# EasyEDA Pro project ProProject_module_robot-.epro

# Schematic Schematic1
Create Date: 2022-07-11; Page Name: P1; Project Name: module_robot; Schematic Name: Schematic1; Update Date: 2022-07-15; Add into BOM: yes; Convert to PCB: yes
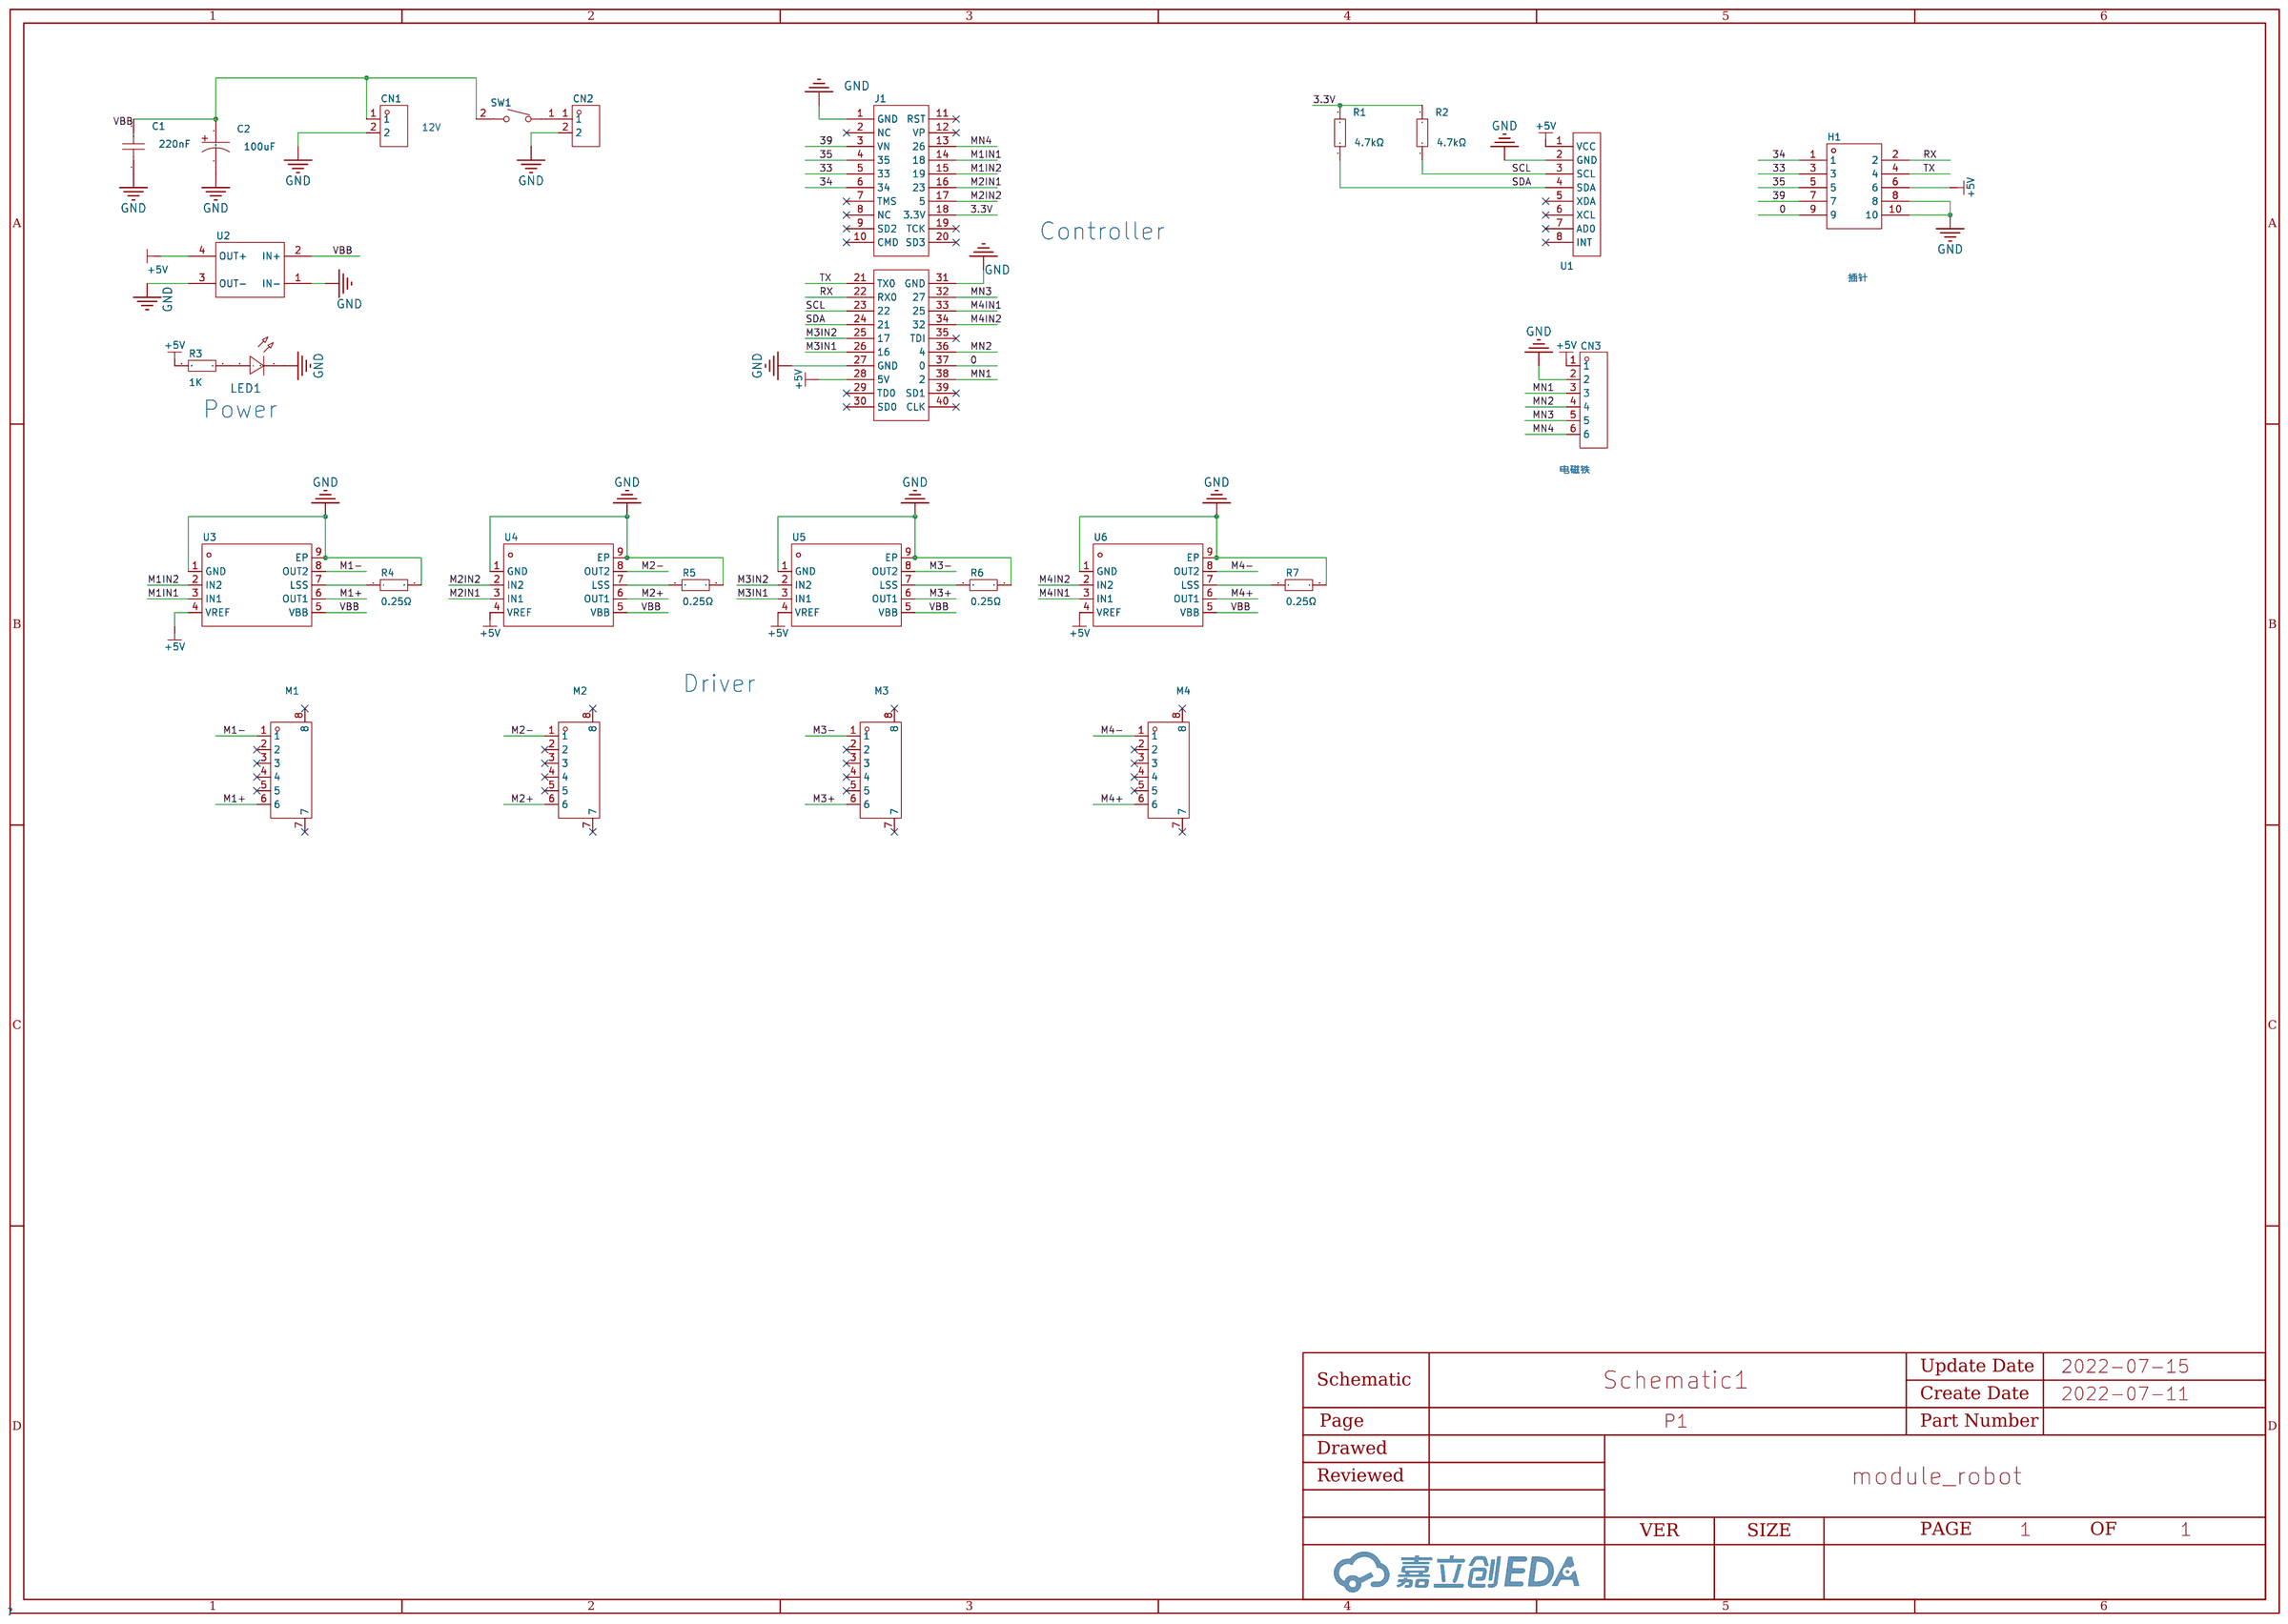
[diagram p0: schematic sheet]

## Parts
C1  220nF  [C0603]
C2  100uF  [CAP-TH_BD8.0-P3.50-D0.6-FD]
CN1  -  [CONN-TH_2P-P2.50_HCTL_HC-5264-2A]
CN2  -  [CONN-TH_2P-P2.50_HCTL_HC-5264-2A]
CN3  -  [CONN-TH_6P-P2.50_HCTL_HC-5264-6A]
H1  -  [HDR-TH_10P-P2.54-V-M-R2-C5-S2.54]
J1  -  [esp32TTGO]
LED1  -  [LED0603-RD_BLUE]
M1  -  [CONN-SMD_KH-ZH1.5WF-06A]
M2  -  [CONN-SMD_KH-ZH1.5WF-06A]
M3  -  [CONN-SMD_KH-ZH1.5WF-06A]
M4  -  [CONN-SMD_KH-ZH1.5WF-06A]
R1  4.7kΩ  [R0805]
R2  4.7kΩ  [R0805]
R3  1K  [R0603]
R4  0.25Ω  [R2512]
R5  0.25Ω  [R2512]
R6  0.25Ω  [R2512]
R7  0.25Ω  [R2512]
SW1  MR5-111-C5N-WW  [SW-TH_MR5-111-C5N-BB]
U1  -  [MPU6050]
U2  -  [DC-DC降压5/3.3V]
U3  -  [SOIC-8_L4.9-W3.9-P1.27-LS6.0-BL-EP]
U4  -  [SOIC-8_L4.9-W3.9-P1.27-LS6.0-BL-EP]
U5  -  [SOIC-8_L4.9-W3.9-P1.27-LS6.0-BL-EP]
U6  -  [SOIC-8_L4.9-W3.9-P1.27-LS6.0-BL-EP]

## Library data of the parts
C1 = TCC0603X5R224M250CT: 容值:220nF;精度:±20%;额定电压:25V;温度系数:X5R;; LCSC Part Name: 220nF ±20% 25V; Supplier Part: C713508; Manufacturer: CCTC(三环); Supplier Footprint: 0603; JLCPCB Part Class: Extended Part; Datasheet: https://atta.szlcsc.com/upload/public/pdf/source/20191203/C466239_F62A586702D44EEA1C39B32FC8662B21.pdf; Supplier: LCSC; Tolerance: ±20%; Voltage Rated: 25V; Temperature Coefficient: X5R
C2 = RG050M101LO8*12TA-1A1E: 电容体长度:12mm;工作寿命:7000hrs 105;额定电压:50V;精度:±20%;容值:100uF;脚间距:3.5mm;电容体直径:8mm;工作温度:-;; LCSC Part Name: 100uF 50V; Supplier Part: C357618; Manufacturer: BERYL(绿宝石); Supplier Footprint: 径向引线,8x12mm; JLCPCB Part Class: Extended Part; Datasheet: https://atta.szlcsc.com/upload/public/pdf/source/20190103/C357618_801ED3488CFC347CF061378E61C4C2ED.pdf; Supplier: LCSC; L: 12mm; Lifetime @ Temp: 7000hrs 105; Rated Voltage: 50V; Tolerance: ±20%; Lead Spacing: 3.5mm; φD: 8mm
CN1 CN2 = HC-5264-2A: 参考系列:-;间距:2.5mm;插针结构:1x2P;排数:1;每排PIN数:2;行距:-;公母:公型插针;安装方式:直插;额定电流:3A;工作温度范围:-25~+85;; LCSC Part Name: 2P 间距P=2.5mm; Supplier Part: C2845814; Manufacturer: HCTL(华灿天禄); Supplier Footprint: 插件,P=2.5mm; JLCPCB Part Class: Extended Part; Datasheet: https://atta.szlcsc.com/upload/public/pdf/source/20210728/C2845814_DFD3D2538445536899F79025E2B03A5C.pdf; Supplier: LCSC; Pitch: 2.5mm; Pins Structure: 1x2P; Number of Rows: 1; Number of PINs Per Row: 2; Gender: 公型插针; Mounting Style: 直插; Current Rating (Max): 3A; Operating Temperature Range: -25~+85
CN3 = HC-5264-6A: 参考系列:-;间距:2.5mm;插针结构:1x6P;排数:1;每排PIN数:6;行距:-;公母:公型插针;安装方式:直插;额定电流:3A;工作温度范围:-25~+85;; LCSC Part Name: 6P 间距P=2.5mm; Supplier Part: C2845818; Manufacturer: HCTL(华灿天禄); Supplier Footprint: 插件,P=2.5mm; JLCPCB Part Class: Extended Part; Datasheet: https://atta.szlcsc.com/upload/public/pdf/source/20210728/C2845814_DFD3D2538445536899F79025E2B03A5C.pdf; Supplier: LCSC; Pitch: 2.5mm; Pins Structure: 1x6P; Number of Rows: 1; Number of PINs Per Row: 6; Gender: 公型插针; Mounting Style: 直插; Current Rating (Max): 3A; Operating Temperature Range: -25~+85
H1 = HDR-M_2.54_2x5: Supplier Part: C124387; Supplier Footprint: 插件,P=2.54mm
J1 = esp32ttgo: esp32TTGO扩展封装
LED1 = LED_0603-R: 发光颜色:红灯;二极管配置:-;透镜颜色:无色透明;主波长:617.5nm;峰值波长:632nm;色温:-;光通量(25时):-;测试电流:5mA;正向电压(VF):2.2V;发光强度:28.5mcd;功率:60mW;发光角度:120°;安装方式:-;工作温度:-40~+85;; Supplier Footprint: 0603; Supplier Part: C72044
M1-M4 = KH-ZH1.5WF-06A: 参考系列:-;间距:1.5mm;插针结构:1x6P;排数:1;每排PIN数:6;行距:-;公母:公型插针;安装方式:卧贴;额定电流:500mA;工作温度范围:-25~+85;; LCSC Part Name: 6P 1.5mm; Supplier Part: C2688783; Manufacturer: kinghelm(金航标); Supplier Footprint: SMD,P=1.5mm; JLCPCB Part Class: Extended Part; Datasheet: https://atta.szlcsc.com/upload/public/pdf/source/20210202/C2688783_C9B428B3014D7ABB89BDB1FE60180D57.pdf; Supplier: LCSC; Pitch: 1.5mm; Pins Structure: 1x6P; Number of Rows: 1; Number of PINs Per Row: 6; Gender: 公型插针; Mounting Style: 卧贴; Current Rating (Max): 500mA; Operating Temperature Range: -25~+85
R1 R2 = AR05DTCW1002: 电阻类型:薄膜电阻;阻值:10kΩ;精度:±0.5%;功率:125mW;温度系数:±25ppm/;最大工作电压:100V;工作温度范围:-55~+155;; LCSC Part Name: 10kΩ ±0.5% 125mW; Supplier Part: C319941; Manufacturer: 光颉(Viking); Supplier Footprint: 0805; JLCPCB Part Class: Extended Part; Datasheet: https://atta.szlcsc.com/upload/public/pdf/source/20181220/C319941_05776DBB286B9ED5294631979742F42B.pdf; Supplier: LCSC; Type: 薄膜电阻; Tolerance: ±0.5%; Power(Watts): 125mW; Temperature Coefficient: ±25ppm/; Overload Voltage (Max): 100V; Operating Temperature Range: -55~+155
R3 = Res_0603: Supplier Footprint: 0603
R4-R7 = CR2512FR250E04R: 阻值:0.25Ω;精度:±1%;功率:1W;温度系数:±600ppm/;; LCSC Part Name: 0.25Ω ±1% 1W; Supplier Part: C147045; Manufacturer: EVER OHMS(天二科技); Supplier Footprint: 2512; JLCPCB Part Class: Extended Part; Datasheet: https://atta.szlcsc.com/upload/public/pdf/source/20190415/C147045_33CEE595C231E45FD259EF7951295D1A.pdf; Supplier: LCSC; Tolerance: ±1%; Power(Watts): 1W; Temperature Coefficient: ±600ppm/
SW1 = MR5-111-C5N-WW: 船型开关@@小型船型开关，10x15在业界少有的; LCSC Part Name: 船型开关; Supplier Part: C2981293; Manufacturer: D-SWITCH(德崧); Supplier Footprint: 插件; Datasheet: https://atta.szlcsc.com/upload/public/pdf/source/20220324/C7B0C801CE9A8534BD2A1473F2C66A3D.pdf; Supplier: LCSC
U1 = MPU6050: MPU6050外形封装
U2 = DC-DC降压5/3.3V
U3-U6 = A4950ELJTR-T: 全桥DMOS PWM电机驱动器; Supplier Part: C82404; Manufacturer: ALLEGRO(美国埃戈罗); Supplier Footprint: SOIC-8_EP_150mil; JLCPCB Part Class: Extended Part; Datasheet: https://atta.szlcsc.com/upload/public/pdf/source/20161024/1477288450284.pdf; Supplier: LCSC

## Nets
3.3V: J1.18(3.3V) R1.2 R2.2
+5V: CN3.1 H1.6 J1.28(5V) R3.1 U1.1(VCC) U2.4(OUT+) U3.4(VREF) U4.4(VREF) U5.4(VREF) U6.4(VREF)
GND: C1.1 C2.2 CN1.2 CN2.2 CN3.2 H1.8 H1.10 J1.1(GND) J1.27(GND) J1.31(GND) LED1.1(C) R4.2 R5.2 R6.2 R7.2 U1.2(GND) U2.1(IN-) U2.3(OUT-) U3.1(GND) U3.9(EP) U4.1(GND) U4.9(EP) U5.1(GND) U5.9(EP) U6.1(GND) U6.9(EP)
0: H1.9 J1.37(0)
33: H1.3 J1.5(33)
34: H1.1 J1.6(34)
35: H1.5 J1.4(35)
39: H1.7 J1.3(VN)
M1+: M1.6 U3.6(OUT1)
M1-: M1.1 U3.8(OUT2)
M1IN1: J1.14(18) U3.3(IN1)
M1IN2: J1.15(19) U3.2(IN2)
M2+: M2.6 U4.6(OUT1)
M2-: M2.1 U4.8(OUT2)
M2IN1: J1.16(23) U4.3(IN1)
M2IN2: J1.17(5) U4.2(IN2)
M3+: M3.6 U5.6(OUT1)
M3-: M3.1 U5.8(OUT2)
M3IN1: J1.26(16) U5.3(IN1)
M3IN2: J1.25(17) U5.2(IN2)
M4+: M4.6 U6.6(OUT1)
M4-: M4.1 U6.8(OUT2)
M4IN1: J1.33(25) U6.3(IN1)
M4IN2: J1.34(32) U6.2(IN2)
MN1: CN3.3 J1.38(2)
MN2: CN3.4 J1.36(4)
MN3: CN3.5 J1.32(27)
MN4: CN3.6 J1.13(26)
RX: H1.2 J1.22(RX0)
SCL: J1.23(22) R2.1 U1.3(SCL)
SDA: J1.24(21) R1.1 U1.4(SDA)
TX: H1.4 J1.21(TX0)
VBB: C1.2 C2.1 CN1.1 SW1.2 U2.2(IN+) U3.5(VBB) U4.5(VBB) U5.5(VBB) U6.5(VBB)
$1N2313: R6.1 U5.7(LSS)
$1N2314: R7.1 U6.7(LSS)
$1N2315: R5.1 U4.7(LSS)
$1N2316: R4.1 U3.7(LSS)
$1N8660: LED1.2(A) R3.2
$1N10061: CN2.1 SW1.1

Not connected (* = marked no-connect by the designer): J1 2(NC)* 7(TMS)* 8(NC)* 9(SD2)* 10(CMD)* 11(RST)* 12(VP)* 19(TCK)* 20(SD3)* 29(TD0)* 30(SD0)* 35(TDI)* 39(SD1)* 40(CLK)*; M1 2* 3* 4* 5* 7* 8*; M2 2* 3* 4* 5* 7* 8*; M3 2* 3* 4* 5* 7* 8*; M4 2* 3* 4* 5* 7* 8*; U1 5(XDA)* 6(XCL)* 7(AD0)* 8(INT)*

## Notes on the sheet
- 12V
- Controller
- 插针
- Power
- 电磁铁
- Driver

# Board PCB1
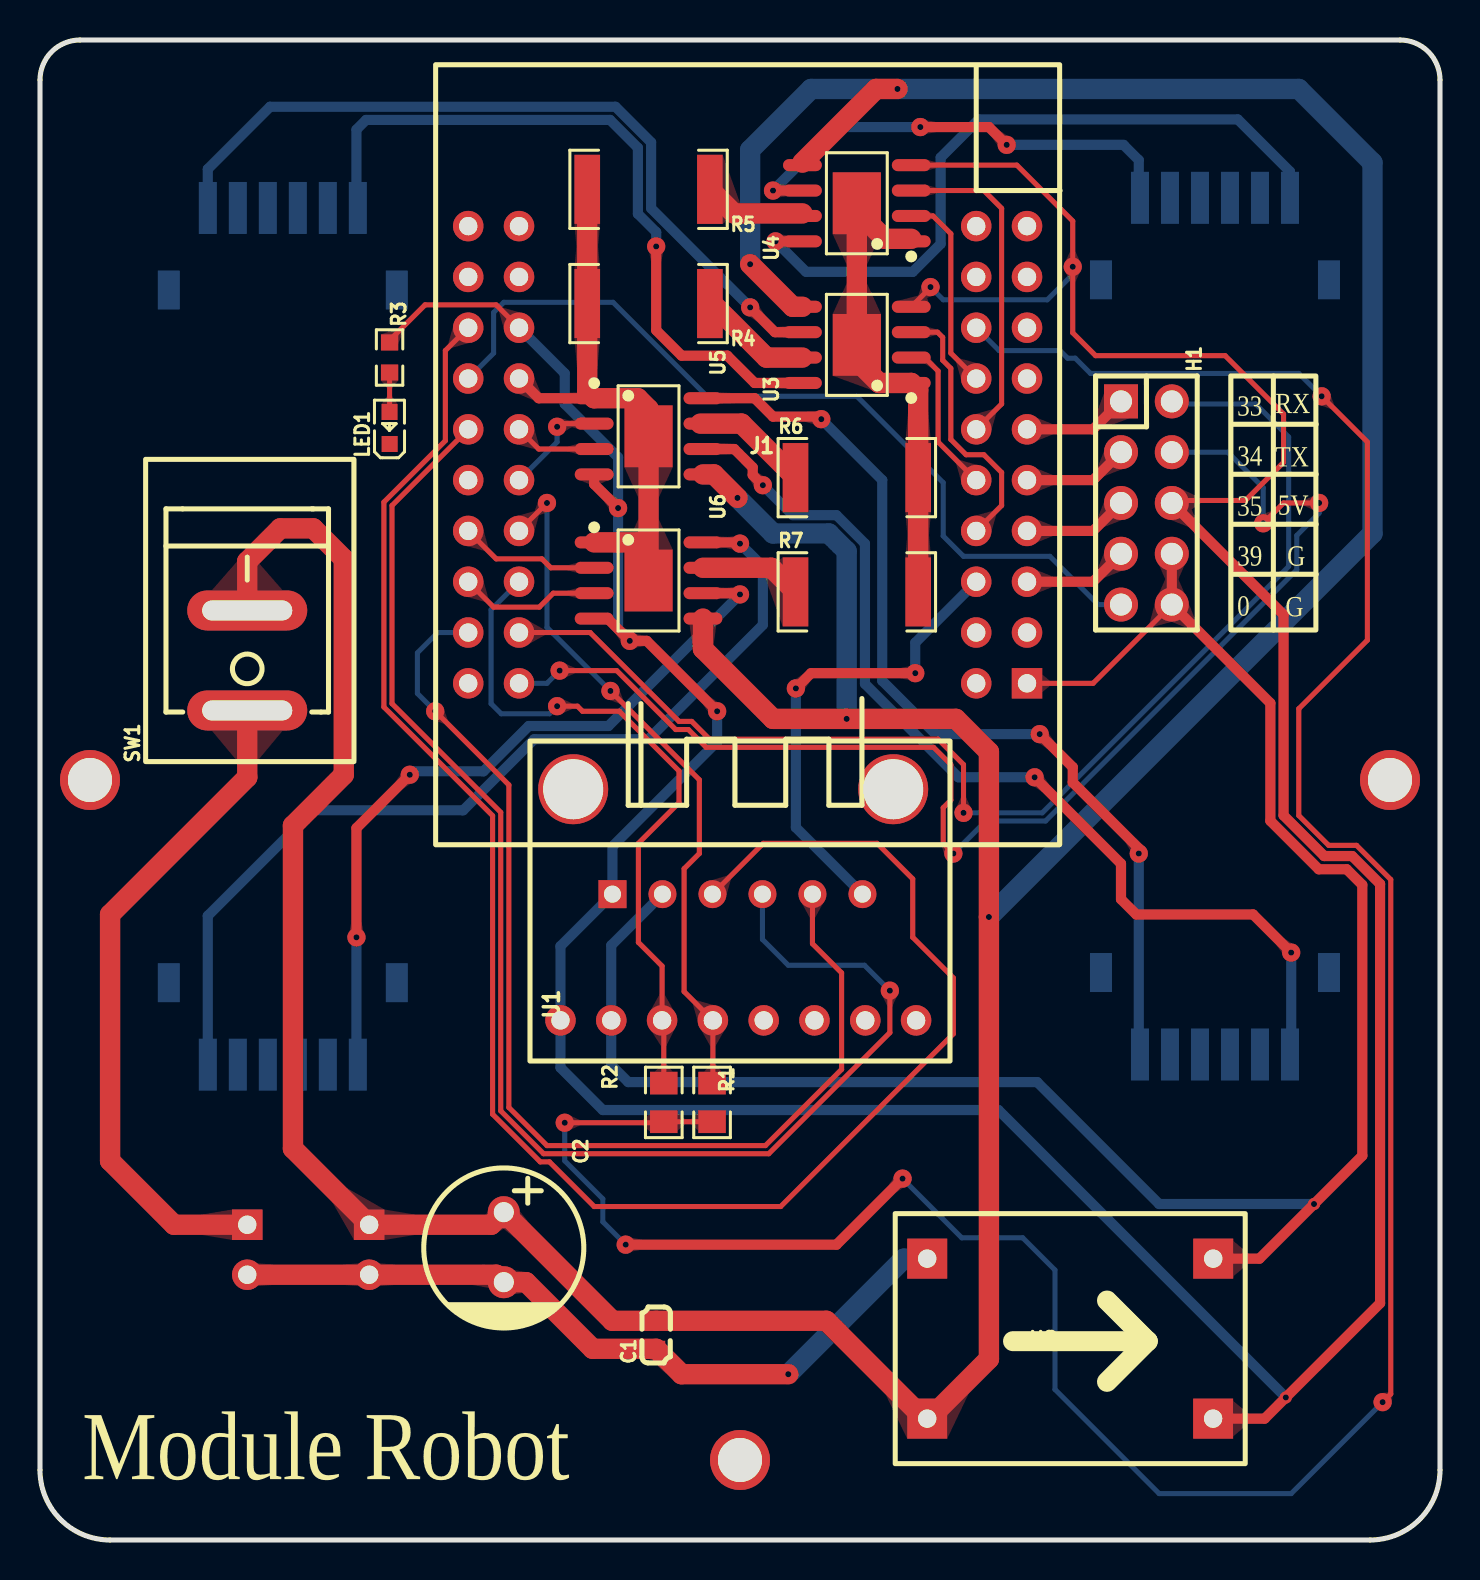
[diagram p1: board, top side]
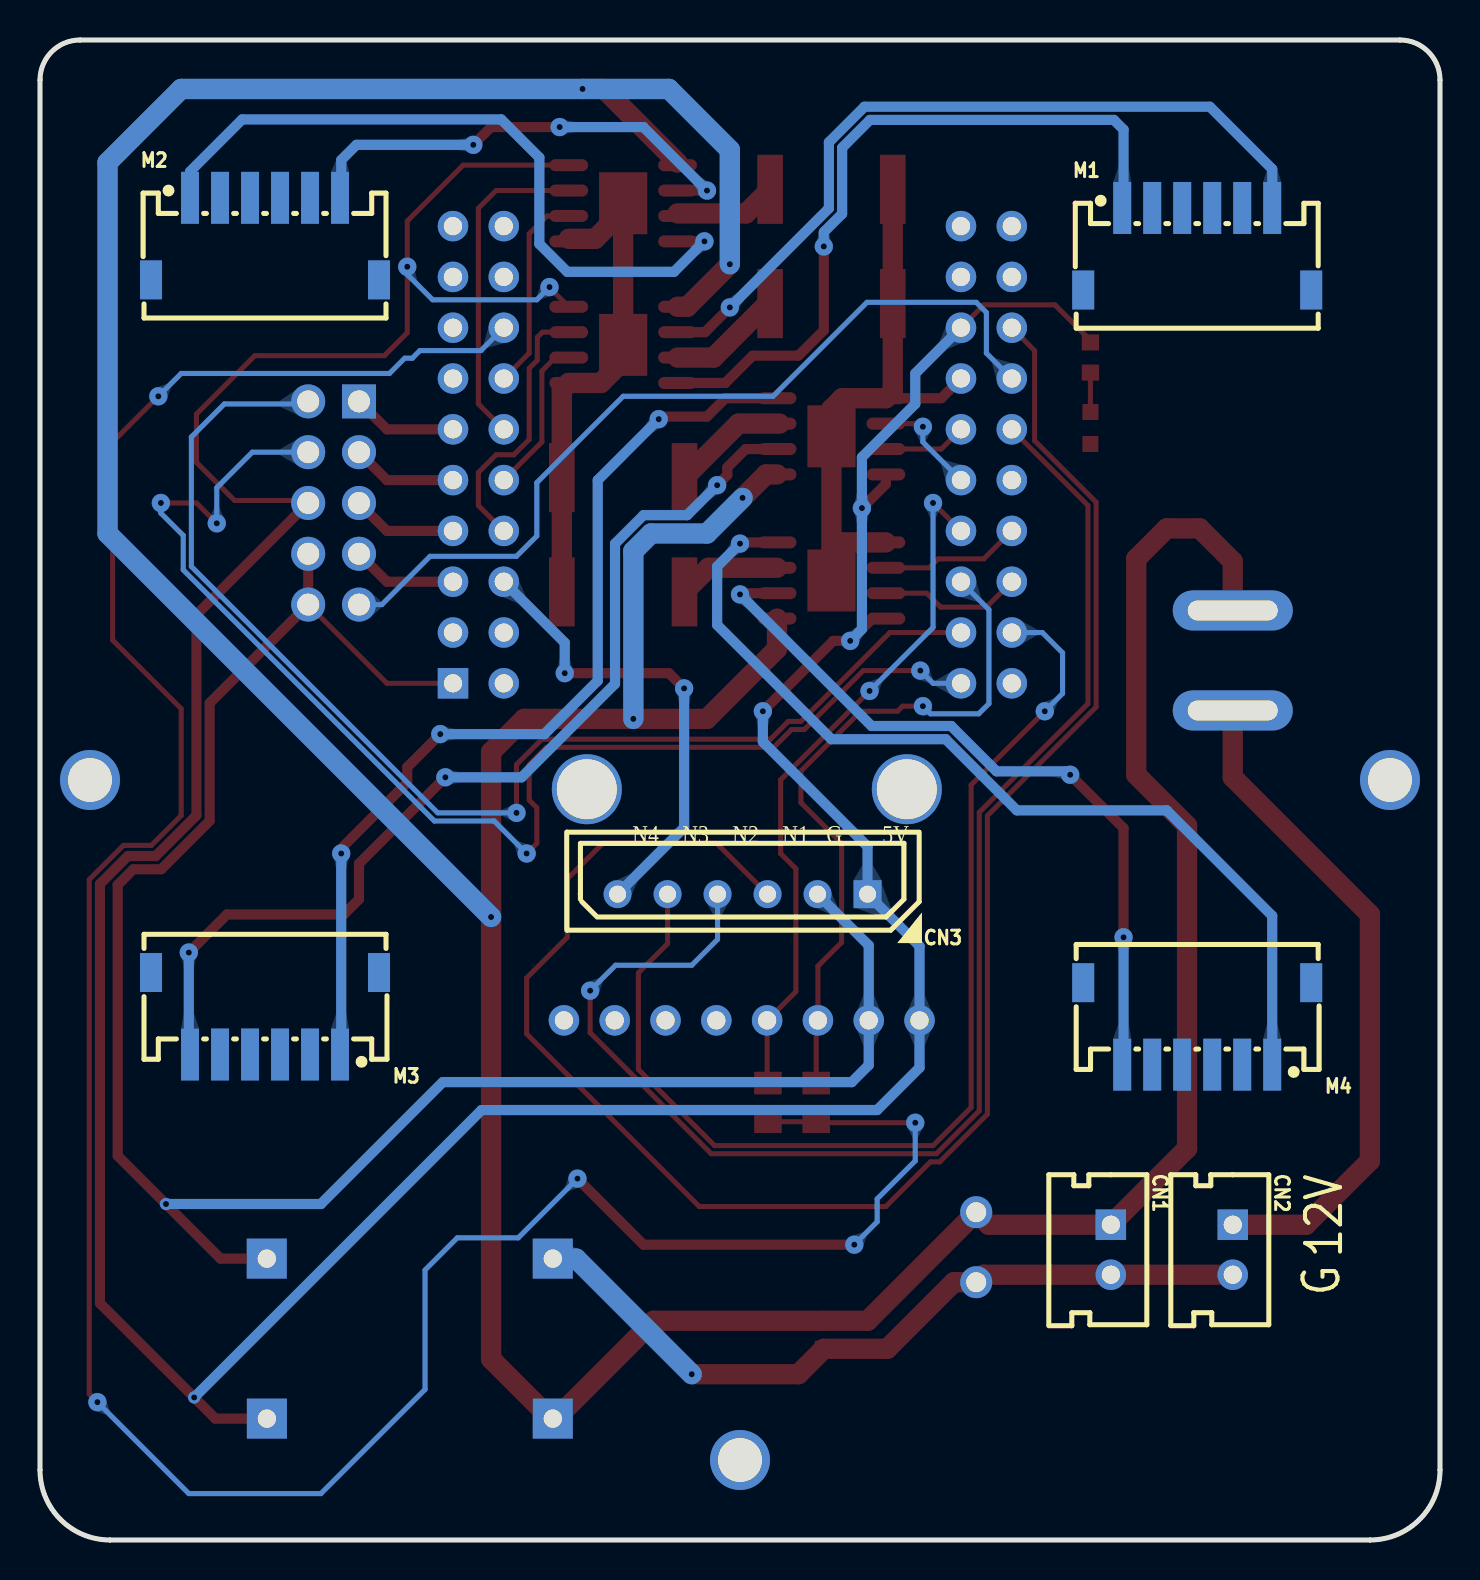
[diagram p2: board, bottom side, seen from below]

Outline 70 x 75 mm; copper layers: Top Layer, Bottom Layer. Coordinates in mm from the lower left corner of the outline.
Outline path: 0,73 arc(0.59,74.41) 2,75 68,75 arc(69.41,74.41) 70,73 70,3.5 arc(68.97,1.03) 66.5,0 3.5,0 arc(1.03,1.03) 0,3.5 0,73
Stack: Top Layer 0.035mm / Dielectric1 1.51mm FR4 er 4.5 / Bottom Layer 0.035mm

## Design rules (mm)
spacing safeClearance (default): track to track 0.152, other pairs 0.152 to 0.3
track width trackWidth (default): min 0.127, default 0.254, max 2.54
differential pair differentialPair (default): width min 0.127, default 0.254, max 2.54; gap min 0.152, default 0.152
via viaSize (default): diameter min 0.5, default 0.61, max 10; hole min 0.3, default 0.305, max 6

## Placement (name value [footprint] x y rotation side)
C1  220nF  [C0603]  30.81 10.26 90 top
C2  100uF  [CAP-TH_BD8.0-P3.50-D0.6-FD]  23.19 14.64 270 top
CN1  -  [CONN-TH_2P-P2.50_HCTL_HC-5264-2A]  16.46 14.51 270 bottom
CN2  -  [CONN-TH_2P-P2.50_HCTL_HC-5264-2A]  10.36 14.51 270 bottom
CN3  -  [CONN-TH_6P-P2.50_HCTL_HC-5264-6A]  34.87 32.29 0 bottom
H1  -  [HDR-TH_10P-P2.54-V-M-R2-C5-S2.54]  55.32 51.85 270 top
J1  -  [esp32TTGO]  35.38 54.26 180 top
LED1  -  [LED0603-RD_BLUE]  17.48 55.6 90 top
M1  -  [CONN-SMD_KH-ZH1.5WF-06A]  12.14 64.55 180 bottom
M2  -  [CONN-SMD_KH-ZH1.5WF-06A]  58.75 65.06 180 bottom
M3  -  [CONN-SMD_KH-ZH1.5WF-06A]  58.75 26.32 0 bottom
M4  -  [CONN-SMD_KH-ZH1.5WF-06A]  12.14 25.82 0 bottom
NOREF  -  [Pad_e193]  67.5 38 0 top
NOREF#2  -  [Pad_e192]  2.5 38 0 top
NOREF#3  -  [Pad_e194]  35 4 0 top
R1  4.7kΩ  [R0805]  33.6 21.88 270 top
R2  4.7kΩ  [R0805]  31.19 21.88 270 top
R3  1K  [R0603]  17.48 59.13 270 top
R4  0.25Ω  [R2512]  30.43 61.82 180 top
R5  0.25Ω  [R2512]  30.43 67.53 180 top
R6  0.25Ω  [R2512]  40.84 53.12 0 top
R7  0.25Ω  [R2512]  40.84 47.41 0 top
SW1  MR5-111-C5N-WW  [SW-TH_MR5-111-C5N-BB]  10.36 43.98 90 top
U1  -  [MPU6050]  26.02 25.98 90 top
U2  -  [DC-DC降压5/3.3V]  51.51 10.07 0 top
U3  -  [SOIC-8_L4.9-W3.9-P1.27-LS6.0-BL-EP]  40.84 59.76 90 top
U4  -  [SOIC-8_L4.9-W3.9-P1.27-LS6.0-BL-EP]  40.84 66.84 90 top
U5  -  [SOIC-8_L4.9-W3.9-P1.27-LS6.0-BL-EP]  30.43 55.18 270 top
U6  -  [SOIC-8_L4.9-W3.9-P1.27-LS6.0-BL-EP]  30.43 47.98 270 top

## Footprints (pads in the part's own frame, mm; a bottom-side part is the same pattern mirrored in y, then rotated)
C0603
  rect 0.8x0.9 smd: 1(-0.7,0) 2(0.7,0)
CAP-TH_BD8.0-P3.50-D0.6-FD
  round 1.6 hole 1: 1(-1.75,0) 2(1.75,0)
CONN-SMD_KH-ZH1.5WF-06A
  rect 0.9x2.6 smd: 1(-3.75,2.05) 2(-2.25,2.05) 3(-0.75,2.05) 4(0.75,2.05) 5(2.25,2.05) 6(3.75,2.05)
  rect 1.1x1.95 smd: 7(5.7,-2.05) 8(-5.7,-2.05)
CONN-TH_2P-P2.50_HCTL_HC-5264-2A
  rect 1.524x1.524 hole 0.914: 1(-1.25,0)
  round 1.524 hole 0.914: 2(1.25,0)
CONN-TH_6P-P2.50_HCTL_HC-5264-6A
  rect 1.4x1.4 hole 0.85: 1(-6.25,0)
  round 1.4 hole 0.85: 2(-3.75,0) 3(-1.25,0) 4(1.25,0) 5(3.75,0) 6(6.25,0)
DC-DC降压5/3.3V
  rect 2x2 hole 0.914: 1(-7.15,4) 2(-7.15,-4) 3(7.15,4) 4(7.145,-4)
esp32TTGO
  rect 1.524x1.524 hole 0.914: 1(-13.97,11.43)
  round 1.524 hole 0.914: 2(-13.97,8.89) 3(-13.97,6.35) 4(-13.97,3.81) 5(-13.97,1.27) 6(-13.97,-1.27) 7(-13.97,-3.81) 8(-13.97,-6.35) 9(-13.97,-8.89) 10(-13.97,-11.43) 11(-11.43,11.43) 12(-11.43,8.89) 13(-11.43,6.35) 14(-11.43,3.81) 15(-11.43,1.27) 16(-11.43,-1.27) 17(-11.43,-3.81) 18(-11.43,-6.35) 19(-11.43,-8.89) 20(-11.43,-11.43) 21(11.43,11.43) 22(11.43,8.89) 23(11.43,6.35) 24(11.43,3.81) 25(11.43,1.27) 26(11.43,-1.27) 27(11.43,-3.81) 28(11.43,-6.35) 29(11.43,-8.89) 30(11.43,-11.43) 31(13.97,11.43) 32(13.97,8.89) 33(13.97,6.35) 34(13.97,3.81) 35(13.97,1.27) 36(13.97,-1.27) 37(13.97,-3.81) 38(13.97,-6.35) 39(13.97,-8.89) 40(13.97,-11.43)
HDR-TH_10P-P2.54-V-M-R2-C5-S2.54
  rect 1.7x1.7 hole 1.1: 1(-5.08,-1.27)
  round 1.7 hole 1.1: 2(-5.08,1.27) 3(-2.54,-1.27) 4(-2.54,1.27) 5(0,-1.27) 6(0,1.27) 7(2.54,-1.27) 8(2.54,1.27) 9(5.08,-1.27) 10(5.08,1.27)
LED0603-RD_BLUE
  rect 0.8x0.8 smd: 1(-0.8,-0.003) 2(0.8,0.003)
MPU6050
  round 1.524 hole 0.914: 1(0,0) 2(0,-2.54) 3(0,-5.08) 4(0,-7.62) 5(0,-10.16) 6(0,-12.7) 7(0,-15.24) 8(0,-17.78)
  round 3.5 hole 3: 9(11.557,-0.635) 10(11.557,-16.635)
Pad_e192
  round 3 hole 2.2: 1(0,0)
Pad_e193
  round 3 hole 2.2: 2(0,0)
Pad_e194
  round 3 hole 2.2: 3(0,0)
R0603
  rect 0.806x0.864 smd: 1(-0.753,0) 2(0.753,0)
R0805
  rect 1.133x1.377 smd: 1(-0.966,0) 2(0.966,0)
R2512
  rect 1.282x3.456 smd: 1(-3.067,0) 2(3.067,0)
SOIC-8_L4.9-W3.9-P1.27-LS6.0-BL-EP
  oval 0.602x1.941 smd: 1(-1.905,-2.72) 2(-0.635,-2.72) 3(0.635,-2.72) 4(1.905,-2.72) 5(1.905,2.72) 6(0.635,2.72) 7(-0.635,2.72) 8(-1.905,2.72)
  rect 3.098x2.41 smd: 9(0,0)
SW-TH_MR5-111-C5N-BB
  oval 2x6 hole 1x4.5: 1(-2.5,0) 2(2.5,0)

## Nets
As in the schematic.

Pads without a net: J1 2 7 8 9 10 11 12 19 20 29 30 35 39 40; M1 2 3 4 5 7 8; M2 2 3 4 5 7 8; M3 2 3 4 5 7 8; M4 2 3 4 5 7 8; NOREF 2; NOREF#2 1; NOREF#3 3; U1 5 6 7 8 9 10

## Via types
v1: diameter 0.914, hole 0.305, Top Layer to Bottom Layer, 42 vias
v2: diameter 0.61, hole 0.305, Top Layer to Bottom Layer, 5 vias

## Routing (per net, layer and track width the routed paths; a pad name or vN(x,y) marks a point on that pad's centre or on a via; arc(x,y) is an arc through that point)
3.3V: length 140.1
  Top Layer w0.254: 33.6,20.91 31.19,20.91 31.14,20.86 v1(26.24,20.86) ; v1(67.13,6.89) 67.54,7.3 67.54,33.02 65.83,34.73 64.43,34.73 62.94,36.22 62.94,41.56 66.37,44.99 66.37,54.9 v1(64.08,57.19)
  Top Layer w0.508: v1(43.13,18.07) 39.83,14.77 v1(29.28,14.77)
  Bottom Layer w0.254: v1(64.08,57.19) 62.94,58.33 52.53,58.33 51.76,59.09 51.38,59.09 51,59.47 47.95,59.47 J1.18 ; v1(43.13,18.07) 46.09,15.11 49.14,15.11 50.75,13.5 50.75,7.53 55.96,2.32 62.56,2.32 v1(67.13,6.89) ; v1(26.24,20.86) 26.24,18.96 28.14,17.05 28.14,15.91 v1(29.28,14.77)
+5V: length 201.6
  Top Layer w0.254: H1.6 56.72,51.98 60.27,51.98 62.18,53.88 62.18,56.3 59.26,59.22 52.78,59.22 51.64,60.36 v1(51.64,63.66) 51.64,65.95 48.84,68.74 U4.4 ; J1.28 22.81,61.76 19.25,61.76 17.48,59.98 17.48,59.88 ; v1(44.53,62.65) 44.53,62.62 U3.4
  Top Layer w0.508: U6.4 28.38,46.07 v1(29.49,44.96) 30.34,44.96 v1(33.86,41.44) ; U5.4 27.71,52.79 v1(28.9,51.6) ; H1.6 62.18,46.26 62.18,36.23 64.21,34.2 65.61,34.2 67,32.8 67,11.84 v2(62.29,7.13) 61.23,6.07 U2.4
  Bottom Layer w0.254: v1(51.64,63.66) 51.64,63.28 50.37,62.01 45.16,62.01 v1(44.53,62.65)
  Bottom Layer w0.508: v1(33.86,41.44) 33.86,39.91 28.62,34.68 CN3.1 26.02,29.69 U1.1 26.02,23.62 28.14,21.5 47.92,21.5 v2(62.29,7.13) ; J1.28 26.24,58.33 26.24,56.8 28.9,54.14 v1(28.9,51.6) 28.9,45.54 v1(29.49,44.96)
GND: length 193.5
  Top Layer w0.254: J1.1 52.65,42.83 H1.10
  Top Layer w0.508: U2.3 60.97,14.07 v2(63.7,16.8) 66.12,19.21 66.12,32.76 65.33,33.54 63.94,33.54 61.52,35.96 61.52,41.84 H1.10 H1.8 ; J1.27 24.94,57.09 U5.1
  Top Layer w1.016: 30.43,49.36 U6.9 ; 30.43,49.36 U5.9 30.43,56.55 29.89,57.09 U5.1 27.36,57.43 27.36,61.95 ; 30.43,49.36 29.91,49.88 U6.1 ; 27.36,61.95 27.33,61.98 27.35,61.96 ; 27.36,61.95 27.49,61.82 ; 27.36,61.95 R5.2 ; 27.36,61.95 27.35,61.96 ; CN2.2 CN1.2 22.82,13.26 C2.2 24.3,12.89 27.63,9.56 C1.1 32.08,8.29 v2(37.41,8.29) ; 43.56,65.06 42.24,65.06 40.84,66.46 40.84,58.96 41.95,57.85 U3.1 43.91,57.51 R6.2 R7.2 ; 27.35,61.96 27.33,61.96
  Bottom Layer w0.508: CN3.2 28.56,29.73 U1.2 28.56,23.74 29.41,22.89 49.86,22.89 55.96,16.8 v2(63.7,16.8)
  Bottom Layer w1.016: U2.1 43.19,14.07 v2(37.41,8.29)
0: length 43.2
  Bottom Layer w0.254: J1.37 22.68,59.34 22.68,61.38 23.19,61.88 28.65,61.88 33.35,57.19 40.84,57.19 45.16,52.87 45.16,50.2 46.18,49.18 50.49,49.18 52.91,46.77 H1.9
33: length 5.3
  Top Layer w0.508: J1.5 52.65,52.99 H1.3
34: length 5.3
  Top Layer w0.508: H1.1 52.65,55.53 J1.6
35: length 5.3
  Top Layer w0.508: J1.4 52.65,50.45 H1.5
39: length 5.3
  Top Layer w0.508: J1.3 52.65,47.91 H1.7
M1+: length 39.6
  Top Layer w0.508: v1(35.51,61.63) 36.75,60.39 U3.6
  Bottom Layer w0.508: M1.6 8.39,68.55 11.5,71.66 28.78,71.66 30.56,69.89 30.56,66.58 v1(35.51,61.63)
M1-: length 36.7
  Top Layer w0.508: v1(30.81,64.68) 30.81,60.49 32.08,59.22 34.37,59.22 35.73,57.85 U3.8
  Bottom Layer w0.508: v1(30.81,64.68) 30.81,65.39 29.89,66.31 29.89,69.61 28.5,71 16.31,71 15.82,70.52 15.82,66.67 M1.1
M1IN1: length 13.6
  Top Layer w0.254: U3.3 44.87,60.39 45.13,60.13 45.13,58.99 45.54,58.58 45.54,55.03 46.3,54.26 47.19,54.26 48.08,53.38 48.08,51.72 J1.14
M1IN2: length 7.9
  Top Layer w0.254: U3.2 44.23,59.12 44.91,58.45 44.91,54.9 J1.15
M2+: length 23.7
  Top Layer w0.508: v1(48.34,69.76) 47.45,70.65 v1(44.02,70.65) ; U4.6 v1(36.65,67.47)
  Bottom Layer w0.508: v1(36.65,67.47) 39.83,70.65 v1(44.02,70.65) ; M2.6 54.94,67.17 54.94,69 54.18,69.76 v1(48.34,69.76)
M2-: length 35.8
  Top Layer w0.508: U4.8 v1(36.78,64.93)
  Bottom Layer w0.508: v1(36.78,64.93) 38.3,63.41 43.64,63.41 45.03,64.81 45.03,69.12 46.94,71.03 59.89,71.03 62.5,68.42 M2.1
M2IN1: length 16.5
  Top Layer w0.254: J1.16 48.08,56.8 48.08,66.58 47.19,67.47 U4.3
M2IN2: length 10.1
  Top Layer w0.254: U4.2 44.65,66.2 45.54,65.31 45.54,59.34 J1.17
M3+: length 50.3
  Top Layer w0.508: v1(49.73,38.14) 54.05,33.82 54.05,32.04 54.81,31.28 60.65,31.28 v1(62.56,29.37) ; U5.6 34.72,54.55 35.63,53.63 35.63,53.25 v1(36.14,52.74)
  Bottom Layer w0.508: M3.6 62.56,24.33 v1(62.56,29.37) ; v1(49.73,38.14) 45.92,38.14 41.25,42.81 41.25,49.82 39.82,51.24 37.64,51.24 v1(36.14,52.74)
M3-: length 47.8
  Top Layer w0.508: v1(54.94,34.33) 54.94,34.58 51.64,37.88 51.64,38.64 v1(49.99,40.29) ; v1(39.06,56.04) 38.94,56.17 36.65,56.17 35.73,57.09 U5.8
  Bottom Layer w0.508: v1(39.06,56.04) 42.11,52.99 42.11,42.96 44.78,40.29 v1(49.99,40.29) ; v1(54.94,34.33) 54.94,24.33 M3.1
M3IN1: length 4.2
  Top Layer w0.254: J1.26 24.94,54.55 U5.3
M3IN2: length 5.4
  Top Layer w0.254: v1(25.86,55.66) 26.01,55.82 U5.2
  Bottom Layer w0.254: J1.25 25.86,54.9 v1(25.86,55.66)
M4+: length 37.8
  Top Layer w0.508: U6.6 34.94,47.34 v1(35,47.28) ; v1(15.82,30.13) 15.82,35.59 v1(18.49,38.26)
  Bottom Layer w0.508: v1(35,47.28) 28.42,40.7 24.44,40.7 22.17,38.43 18.66,38.43 v1(18.49,38.26) ; v1(15.82,30.13) 15.82,23.83 M4.6
M4-: length 47.6
  Top Layer w0.508: v1(35,49.82) 34.94,49.88 U6.8
  Bottom Layer w0.508: M4.1 8.39,31.21 13.66,36.48 21.16,36.48 24.71,40.04 30.43,40.04 36.14,45.75 36.14,48.68 v1(35,49.82)
M4IN1: length 7.1
  Top Layer w0.254: U6.3 25.66,47.34 24.97,46.64 22.68,46.64 J1.33
M4IN2: length 7.1
  Top Layer w0.254: J1.34 22.81,49.06 25.09,49.06 25.54,48.61 U6.2
MN1: length 92.2
  Top Layer w0.254: CN3.3 36.16,34.83 41.86,34.83 43.64,33.06 43.64,30.13 45.67,28.1 45.67,25.31 37.03,16.67 27.71,16.67 25.47,18.91 25.01,18.91 22.63,21.29 22.63,36.21 17.19,41.65 17.19,51.89 20.27,54.97 20.27,59.47 J1.38
MN2: length 72.6
  Top Layer w0.254: v1(42.49,27.47) 42.49,25.37 36.44,19.31 25.18,19.31 23.04,21.46 23.04,36.38 17.6,41.82 17.6,51.72 J1.36
  Bottom Layer w0.254: CN3.4 36.12,30.03 37.41,28.74 41.22,28.74 v1(42.49,27.47)
MN3: length 56
  Top Layer w0.254: v1(19.76,41.44) 23.44,37.75 23.44,21.62 25.35,19.72 36.27,19.72 40.08,23.53 40.08,28.36 38.62,29.81 CN3.5
  Bottom Layer w0.254: v1(19.76,41.44) 18.87,42.33 18.87,44.36 19.89,45.37 J1.32
MN4: length 23.8
  Top Layer w0.508: v1(43.76,43.34) 38.56,43.34 v1(37.79,42.58)
  Bottom Layer w0.508: J1.13 43.76,44.87 v1(43.76,43.34) ; CN3.6 37.79,35.62 v1(37.79,42.58)
RX: length 61.8
  Top Layer w0.254: v1(46.18,36.36) 46.18,38.77 44.91,40.04 33.48,40.04 32.59,40.93 31.95,40.93 27.51,45.37 J1.22
  Bottom Layer w0.254: v1(46.18,36.36) 50.11,36.36 62.43,48.68 62.43,55.15 60.78,56.8 56.72,56.8 H1.2
SCL: length 34.8
  Top Layer w0.254: v1(25.86,41.69) 26.87,41.69 27.13,41.44 28.96,41.44 31.95,38.45 31.95,36.86 29.92,34.83 29.92,29.88 31.1,28.7 U1.3 31.19,25.9 R2.1
  Bottom Layer w0.254: v1(25.86,41.69) 25.47,41.31 23.06,41.31 22.55,41.82 22.55,46.52 J1.23
SDA: length 35.1
  Top Layer w0.254: v1(28.52,42.45) 32.97,38.01 32.97,34.33 32.21,33.56 32.21,27.42 U1.4 33.64,22.89 R1.1 ; J1.24 v1(25.35,51.85)
  Bottom Layer w0.254: v1(25.35,51.85) 25.35,45.63 v1(28.52,42.45)
TX: length 65.8
  Top Layer w0.254: v1(63.96,51.85) 62.18,51.85 v1(61.16,50.83) ; v1(45.67,34.33) 45.16,34.83 45.16,36.61 45.54,36.99 45.54,38.77 44.68,39.63 33.31,39.63 32.42,40.52 31.78,40.52 28.84,43.47 v1(25.98,43.47)
  Bottom Layer w0.254: H1.4 59.38,54.39 61.16,52.61 v1(61.16,50.83) ; v1(25.98,43.47) 25.35,42.83 J1.21 ; v1(63.96,51.85) 63.96,51.34 62.84,50.23 62.84,48.51 50.28,35.95 47.29,35.95 v1(45.67,34.33)
VBB: length 241.9
  Top Layer w1.016: v1(35.51,63.79) 37.64,61.66 U3.5 ; v2(34.87,52.11) 33.7,53.28 U5.5 ; 38.12,68.87 41.8,72.55 v1(42.87,72.55) ; SW1.2 10.36,48.93 12.01,50.58 13.66,50.58 15.19,49.06 15.19,38.26 12.65,35.72 12.65,19.57 CN1.1 22.56,15.76 C2.1 28.62,10.96 C1.2 39.31,10.96 44.33,5.94 47.45,9.05 v1(47.45,31.15) 47.45,39.41 45.79,41.06 v2(40.33,41.06) 36.65,41.06 33.15,44.56 U6.5
  Bottom Layer w1.016: v2(40.33,41.06) 40.33,49.44 39.44,50.33 36.65,50.33 v2(34.87,52.11) ; v1(35.51,63.79) 35.51,69.5 38.56,72.55 v1(42.87,72.55) 62.94,72.55 66.62,68.87 66.62,50.33 v1(47.45,31.15)
$1N2313: length 5.9
  Top Layer w1.016: R6.1 35.08,55.82 33.02,55.82
$1N2314: length 5.1
  Top Layer w1.016: R7.1 36.57,48.61 U6.7
$1N2315: length 5.1
  Top Layer w1.016: R5.1 34.7,66.33 38.12,66.33
$1N2316: length 5.6
  Top Layer w1.016: 33.62,61.82 36.32,59.12 U3.7
$1N8660: length 2
  Top Layer w0.254: R3.2 17.48,56.4 LED1.2
$1N10061: length 33.5
  Top Layer w1.016: SW1.1 10.36,38.14 3.5,31.28 3.5,18.96 6.7,15.76 CN2.1

## Copper pours and planes (outline as drawn; the poured copper is in the pictures)
GND on Top Layer: -3.86,78.9 72.85,78.9 72.85,-3.27 -3.86,-3.27
GND on Bottom Layer: -7.42,80.55 75.77,80.55 75.77,-5.81 -7.42,-5.81

Small or netless copper shapes (teardrops, artwork), in the pictures only: 135 on Top Layer, 69 on Bottom Layer

## Text on the board
Bottom Silkscreen Layer: 12V | G | 5V | N1 | N2 | N3 | N4
Top Silkscreen Layer: 33 | 34 | 35 | 39 | 0 | RX | TX | 5V | G | Module Robot
